# Altium schematic sheet PWM Inputs.SchDoc: Title
size A4; Project: Q24 VCU; ENG_APP_DATE: --/--/--; DSN_APP_DATE: --/--/--; CHK_APP_DATE: --/--/--; Date: *******; ApprovedBy: *******; CheckedBy: None; Author: *******; CompanyName: *******; DrawnBy: Jacob Chisholm; Engineer: *******; Organization: *******; Address1: *******; Address2: *******; Address3: *******; Address4: *******; DocumentNumber: 1; Revision: *******; SheetNumber: 1; SheetTotal: *******; Address_Website: https://jchisholm204.github.io; E-Mail: JacobChisholm1010@gmail.com; CurrentTime: *******; CurrentDate: *******; Time: *******; DocumentFullPathAndName: *******; DocumentName: *******; ModifiedDate: *******; ImagePath: *******; ProjectName: *******; Application_BuildNumber: *******
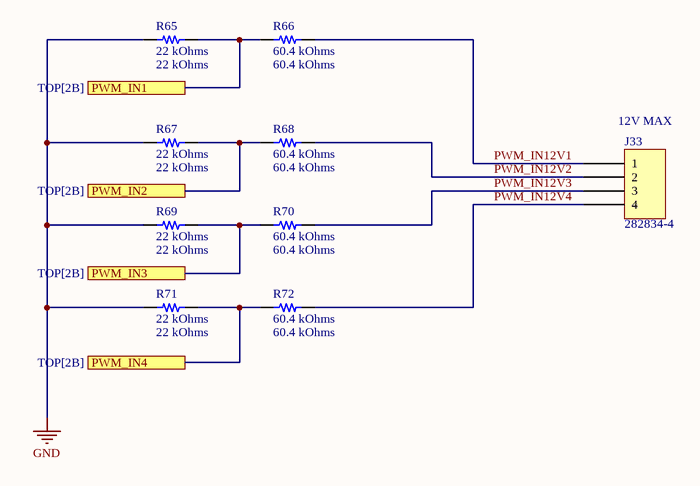
[diagram p0: PWM Inputs.SchDoc]

## Parts
J33  282834-4  [TE 282834-4]
R65  22 kOhms  [RES 0603_1608]
R66  60.4 kOhms  [RES 0603_1608]
R67  22 kOhms  [RES 0603_1608]
R68  60.4 kOhms  [RES 0603_1608]
R69  22 kOhms  [RES 0603_1608]
R70  60.4 kOhms  [RES 0603_1608]
R71  22 kOhms  [RES 0603_1608]
R72  60.4 kOhms  [RES 0603_1608]

## Ports
PWM_IN1 (see TOP[2B]), PWM_IN2 (see TOP[2B]), PWM_IN3 (see TOP[2B]), PWM_IN4 (see TOP[2B])

## Nets
GND: R65.2 R67.2 R69.2 R71.2
PWM_IN1: R65.1 R66.2 ; port PWM_IN1
PWM_IN2: R67.1 R68.2 ; port PWM_IN2
PWM_IN3: R69.1 R70.2 ; port PWM_IN3
PWM_IN4: R71.1 R72.2 ; port PWM_IN4
PWM_IN12V1: J33.1 R66.1
PWM_IN12V2: J33.2 R68.1
PWM_IN12V3: J33.3 R70.1
PWM_IN12V4: J33.4 R72.1

## Notes on the sheet
- (near J33) 12V MAX
- Title:
- Drawn By:
- Page Contents:
- Checked By:
- Size:
- Date:
- File:
- License:
- Email:
- A4
- Number:
- Time:
- Revision:
- Sheet
- Website:
- of

## Library data of the parts
J33 = 282834-4: TERM BLK 4P SIDE ENT 2.54MM PCB; Manufacturer: TE Connectivity AMP Connectors; Current: 10A; Mating Orientation: Horizontal with Board; Number of Levels: 1; Pitch: 0.100" (2.54mm); Positions Per Level: 4; Voltage: 150V; Wire Gauge: 16-30 AWG; Wire Termination: Screw - Rising Cage Clamp; Part Number: 282834-4; Color: Green; ComponentLink1Description: Datasheet; ComponentLink1URL: https://www.te.com/commerce/DocumentDelivery/DDEController?Action=srchrtrv&DocNm=282834&DocType=Customer+Drawing&DocLang=English; ComponentLink2Description: DigiKey Link; ComponentLink2URL: http://digikey.com/product-detail/en/te-connectivity-amp-connectors/282834-4/A98335-ND/1153265; LastUpdated: 1/15/2020 4:16:05 AM; Lifecycle Status: Active; Minimum Order: 1; Mounting Type: Through Hole; Packaging: Bulk; Part Status: Active; Price: 2.68; Series: Buchanan; Supplier 1: DigiKey; Supplier Part Number 1: A98335-ND
R65 R67 R69 R71 = AC0603FR-7W22KL: RES 22K OHM 1% 1/5W 0603; Part Number: AC0603FR-7W22KL; Value: 22 kOhms
R66 R68 R70 R72 = AC0603FR-0760K4L: RES SMD 60.4K OHM 1% 1/10W 0603; Part Number: AC0603FR-0760K4L; Value: 60.4 kOhms